# EAGLE schematic schem1 (EAGLE 9.2.2)
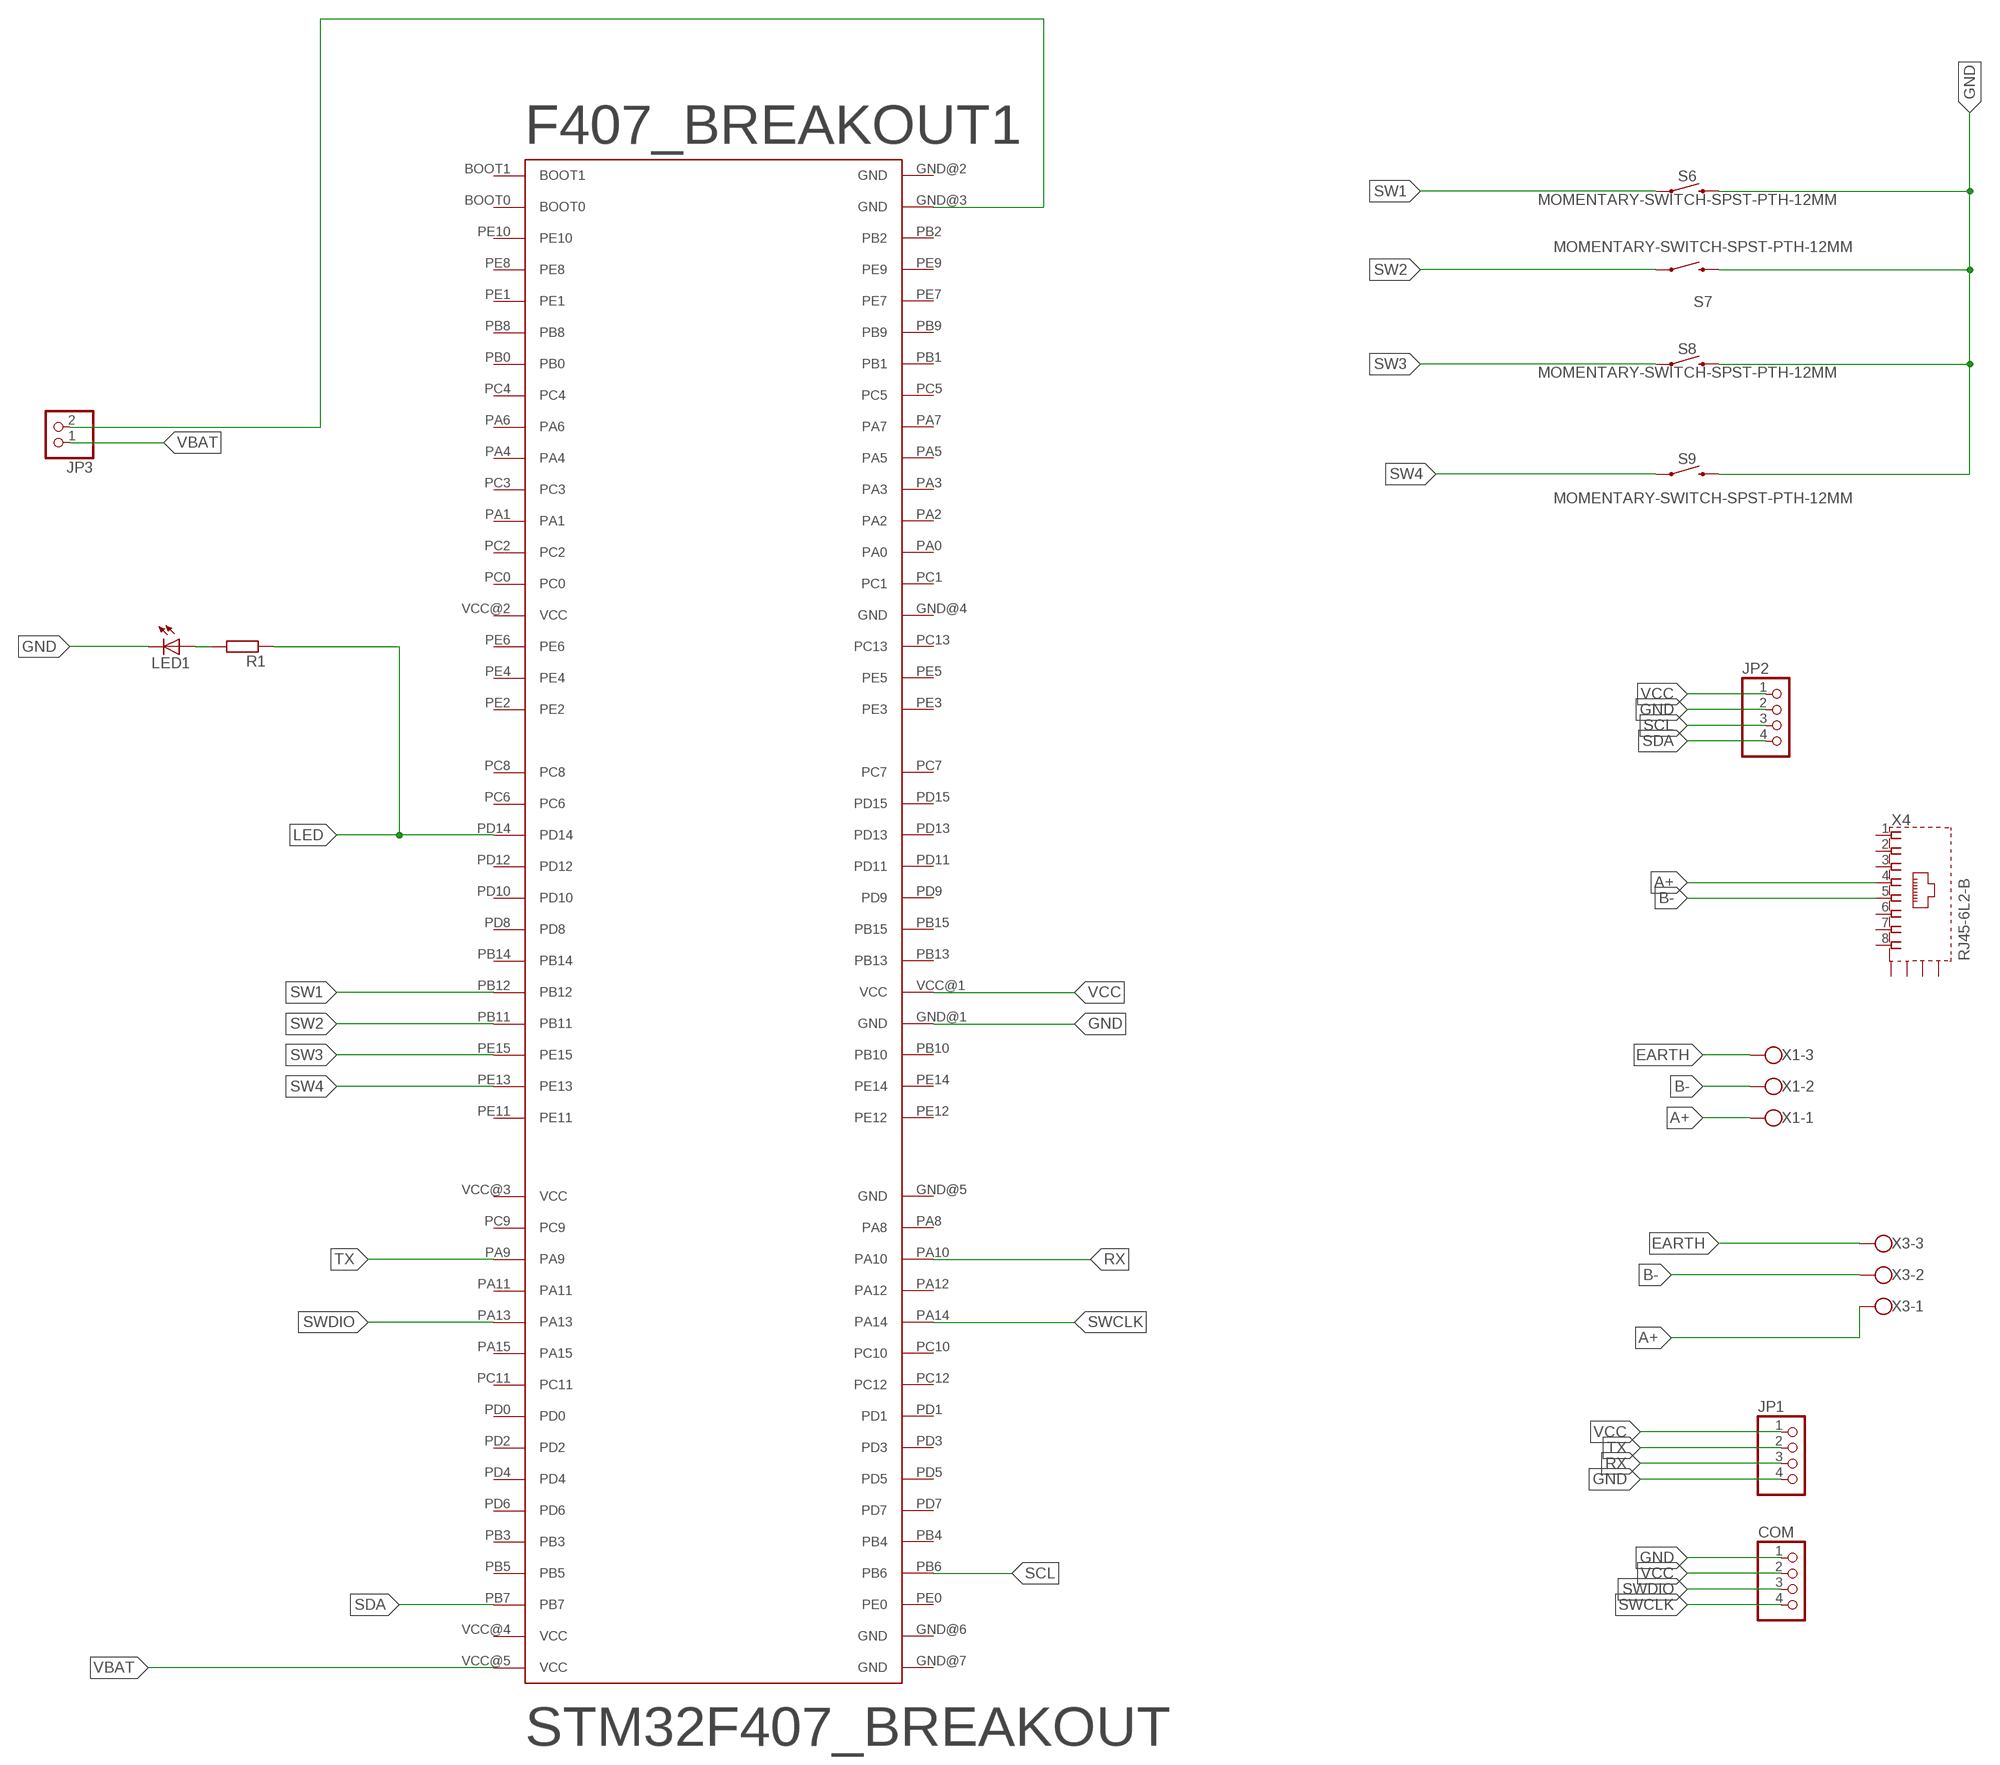
[diagram p0: schematic, sheet 1]

## Parts
COM  PINHD-1X4  [1X04]
F407_BREAKOUT1  STM32F407_BREAKOUT  [STM32F407_BREAKOUT]
JP1  PINHD-1X4  [1X04]
JP2  PINHD-1X4  [1X04]
JP3  PINHD-1X2  [1X02]
LED1  LED3MM  [LED3MM]
R1  R-EU_0207/10  [0207/10]
S6  MOMENTARY-SWITCH-SPST-PTH-12MM  [TACTILE_SWITCH_PTH_12MM]
S7  MOMENTARY-SWITCH-SPST-PTH-12MM  [TACTILE_SWITCH_PTH_12MM]
S8  MOMENTARY-SWITCH-SPST-PTH-12MM  [TACTILE_SWITCH_PTH_12MM]
S9  MOMENTARY-SWITCH-SPST-PTH-12MM  [TACTILE_SWITCH_PTH_12MM]
X1  W237-103  [W237-103]
X3  W237-103  [W237-103]
X4  RJ45-6L2-B  [RJ45-SHIELD2]

## Nets
A+: X1.1 X3.1 X4.4
B-: X1.2 X3.2 X4.5
EARTH: X1.3 X3.3
GND: COM.1 F407_BREAKOUT1.GND@1(GND) JP1.4 JP2.2 LED1.K(C) S6.3 S7.3 S8.3 S9.3
LED: F407_BREAKOUT1.PD14 R1.1
N$1: LED1.A R1.2
N$2: F407_BREAKOUT1.GND@3(GND) JP3.2
RX: F407_BREAKOUT1.PA10 JP1.3
SCL: F407_BREAKOUT1.PB6 JP2.3
SDA: F407_BREAKOUT1.PB7 JP2.4
SW1: F407_BREAKOUT1.PB12 S6.1
SW2: F407_BREAKOUT1.PB11 S7.1
SW3: F407_BREAKOUT1.PE15 S8.1
SW4: F407_BREAKOUT1.PE13 S9.1
SWCLK: COM.4 F407_BREAKOUT1.PA14
SWDIO: COM.3 F407_BREAKOUT1.PA13
TX: F407_BREAKOUT1.PA9 JP1.2
VBAT: F407_BREAKOUT1.VCC@5(VCC) JP3.1
VCC: COM.2 F407_BREAKOUT1.VCC@1(VCC) JP1.1 JP2.1
Unconnected: F407_BREAKOUT1.BOOT0 F407_BREAKOUT1.BOOT1 F407_BREAKOUT1.GND@2(GND) F407_BREAKOUT1.GND@4(GND) F407_BREAKOUT1.GND@5(GND) F407_BREAKOUT1.GND@6(GND) F407_BREAKOUT1.GND@7(GND) F407_BREAKOUT1.PA0 F407_BREAKOUT1.PA1 F407_BREAKOUT1.PA2 F407_BREAKOUT1.PA3 F407_BREAKOUT1.PA4 F407_BREAKOUT1.PA5 F407_BREAKOUT1.PA6 F407_BREAKOUT1.PA7 F407_BREAKOUT1.PA8 F407_BREAKOUT1.PA11 F407_BREAKOUT1.PA12 F407_BREAKOUT1.PA15 F407_BREAKOUT1.PB0 F407_BREAKOUT1.PB1 F407_BREAKOUT1.PB2 F407_BREAKOUT1.PB3 F407_BREAKOUT1.PB4 F407_BREAKOUT1.PB5 F407_BREAKOUT1.PB8 F407_BREAKOUT1.PB9 F407_BREAKOUT1.PB10 F407_BREAKOUT1.PB13 F407_BREAKOUT1.PB14 F407_BREAKOUT1.PB15 F407_BREAKOUT1.PC0 F407_BREAKOUT1.PC1 F407_BREAKOUT1.PC2 F407_BREAKOUT1.PC3 F407_BREAKOUT1.PC4 F407_BREAKOUT1.PC5 F407_BREAKOUT1.PC6 F407_BREAKOUT1.PC7 F407_BREAKOUT1.PC8 F407_BREAKOUT1.PC9 F407_BREAKOUT1.PC10 F407_BREAKOUT1.PC11 F407_BREAKOUT1.PC12 F407_BREAKOUT1.PC13 F407_BREAKOUT1.PD0 F407_BREAKOUT1.PD1 F407_BREAKOUT1.PD2 F407_BREAKOUT1.PD3 F407_BREAKOUT1.PD4 F407_BREAKOUT1.PD5 F407_BREAKOUT1.PD6 F407_BREAKOUT1.PD7 F407_BREAKOUT1.PD8 F407_BREAKOUT1.PD9 F407_BREAKOUT1.PD10 F407_BREAKOUT1.PD11 F407_BREAKOUT1.PD12 F407_BREAKOUT1.PD13 F407_BREAKOUT1.PD15 F407_BREAKOUT1.PE0 F407_BREAKOUT1.PE1 F407_BREAKOUT1.PE2 F407_BREAKOUT1.PE3 F407_BREAKOUT1.PE4 F407_BREAKOUT1.PE5 F407_BREAKOUT1.PE6 F407_BREAKOUT1.PE7 F407_BREAKOUT1.PE8 F407_BREAKOUT1.PE9 F407_BREAKOUT1.PE10 F407_BREAKOUT1.PE11 F407_BREAKOUT1.PE12 F407_BREAKOUT1.PE14 F407_BREAKOUT1.VCC@2(VCC) F407_BREAKOUT1.VCC@3(VCC) F407_BREAKOUT1.VCC@4(VCC) X4.1 X4.2 X4.3 X4.6 X4.7 X4.8 X4.S1(S) X4.S2(S) X4.S3(S) X4.S4(S)

## Library data of the parts
COM JP1 JP2 = pinhead:PINHD-1X4: PIN HEADER
F407_BREAKOUT1 = stm32f407breakout:STM32F407_BREAKOUT
JP3 = pinhead:PINHD-1X2: PIN HEADER
LED1 = led:LED: LED OSRAM: - CHIPLED LG R971, LG N971, LY N971, LG Q971, LY Q971, LO R971, LY R971 LH N974, LH R974 LS Q976, LO Q976, LY Q976 LO Q996 - Hyper CHIPLED LW Q18S LB Q993, LB Q99A, LB R99A - SideLED LS A670, LO A670, LY A670, LG A670, LP A670 LB A673, LV A673, LT A673, LW A673 LH A674 LY A675 LS A676, LA A676, LO A676, LY A676, LW A676 LS A679, LY A679, LG A679 - Hyper Micro SIDELED® LS Y876, LA Y876, LO Y876, LY Y876 LT Y87S - SmartLED LW L88C, LW L88S LB L89C, LB L89S, LG L890 LS L89K, LO L89K, LY L89K LS L896, LA L896, LO L896, LY L896 - TOPLED LS T670, LO T670, LY T670, LG T670, LP T670 LSG T670, LSP T670, LSY T670, LOP T670, LYG T670 LG T671, LOG T671, LSG T671 LB T673, LV T673, LT T673, LW T673 LH T674 LS T676, LA T676, LO T676, LY T676, LB T676, LH T676, LSB T676, LW T676 LB T67C, LV T67C, LT T67C, LS T67K, LO T67K, LY T67K, LW E67C LS E67B, LA E67B, LO E67B, LY E67B, LB E67C, LV E67C, LT E67C LW T67C LS T679, LY T679, LG T679 LS T770, LO T770, LY T770, LG T770, LP T770 LB T773, LV T773, LT T773, LW T773 LH T774 LS E675, LA E675, LY E675, LS T675 LS T776, LA T776, LO T776, LY T776, LB T776 LHGB T686 LT T68C, LB T68C - Hyper Mini TOPLED® LB M676 - Mini TOPLED Santana® LG M470 LS M47K, LO M47K, LY M47K Source: http://www.osram.convergy.de LUXEON: - LUMILED® LXK2-PW12-R00, LXK2-PW12-S00, LXK2-PW14-U00, LXK2-PW14-V00 LXK2-PM12-R00, LXK2-PM12-S00, LXK2-PM14-U00 LXK2-PE12-Q00, LXK2-PE12-R00, LXK2-PE12-S00, LXK2-PE14-T00, LXK2-PE14-U00 LXK2-PB12-K00, LXK2-PB12-L00, LXK2-PB12-M00, LXK2-PB14-N00, LXK2-PB14-P00, LXK2-PB14-Q00 LXK2-PR12-L00, LXK2-PR12-M00, LXK2-PR14-Q00, LXK2-PR14-R00 LXK2-PD12-Q00, LXK2-PD12-R00, LXK2-PD12-S00 LXK2-PH12-R00, LXK2-PH12-S00 LXK2-PL12-P00, LXK2-PL12-Q00, LXK2-PL12-R00 Source: www.luxeon.com KINGBRIGHT: KA-3528ASYC Source: www.kingbright.com
R1 = rcl:R-EU_: RESISTOR, European symbol; SPICEPREFIX: R
S6-S9 = SparkFun-Switches:MOMENTARY-SWITCH-SPST: Momentary Switch (Pushbutton) - SPST Normally-open (NO) SPST momentary switches (buttons, pushbuttons). Variants PTH-12MM - 12mm square, through-hole Momentary Pushbutton Switch - 12mm Square <https://www.sparkfun.com/products/9190> (COM-09190) PTH-6.0MM, PTH-6.0MM-KIT - 6.0mm square, through-hole Mini Pushbutton Switch <https://www.sparkfun.com/products/97> (COM-00097) KIT package intended for soldering kit's - only one side of pads' copper is exposed. PTH-RIGHT-ANGLE-KIT - Right-angle, through-hole Right Angle Tactile Button <https://www.sparkfun.com/products/10791> - Used on SparkFun BigTime Watch Kit <https://www.sparkfun.com/products/11734> SMD-12MM - 12mm square, surface-mount Tactile Button - SMD (12mm) <https://www.sparkfun.com/products/12993> (COM-12993) Used on SparkFun PicoBoard <https://www.sparkfun.com/products/11888> SMD-4.5MM - 4.5mm Square Trackball Switch Used on SparkFun Blackberry Trackballer Breakout <https://www.sparkfun.com/products/13169> SMD-4.6MMX2.8MM - 4.60mm x 2.80mm, surface mount Used on SparkFun SAMD21 Mini Breakout <https://www.sparkfun.com/products/13664> SMD-5.2MM, SMD-5.2-REDUNDANT - 5.2mm square, surface-mount Mini Pushbutton Switch - SMD <https://www.sparkfun.com/products/8720> (COM-08720) Used on Arduino Pro Mini <https://www.sparkfun.com/products/11114> REDUNDANT package connects both switch circuits together SMD-6.0X3.5MM - 6.0 x 3.5mm, surface mount Momentary Reset Switch SMD <https://www.sparkfun.com/products/8229> (COM-08229) SMD-6.2MM-TALL - 6.2mm square, surface mount Tactile Button - SMD (6mm) <https://www.sparkfun.com/products/12992> Used on SparkFun Digital Sandbox <https://www.sparkfun.com/products/12651> SMD-RIGHT-ANGLE - Right-angle, surface mount Used on SparkFun Block for Intel® Edison - Arduino <https://www.sparkfun.com/products/13036>; PROD_ID: SWCH-09185; SF_SKU: COM-09190
X1 X3 = con-wago-500:W237-103: WAGO SCREW CLAMP; MPN: 237-103; OC_FARNELL: unknown; OC_NEWARK: 18M7116
X4 = con-tycoelectronics:RJ45*2: RJ45 Low Profile Shield Type 2 For all RJ45 L, LC, LCT and X Series Models Source: www.tycoelectronics.com .. ENG_DS_1654001_1099_RJ_L_0507.pdf; MPN: RJ45-6L2-B; OC_FARNELL: unknown; OC_NEWARK: 16R6096